# EAGLE design pcb_Vgood (EAGLE 9.3.0)
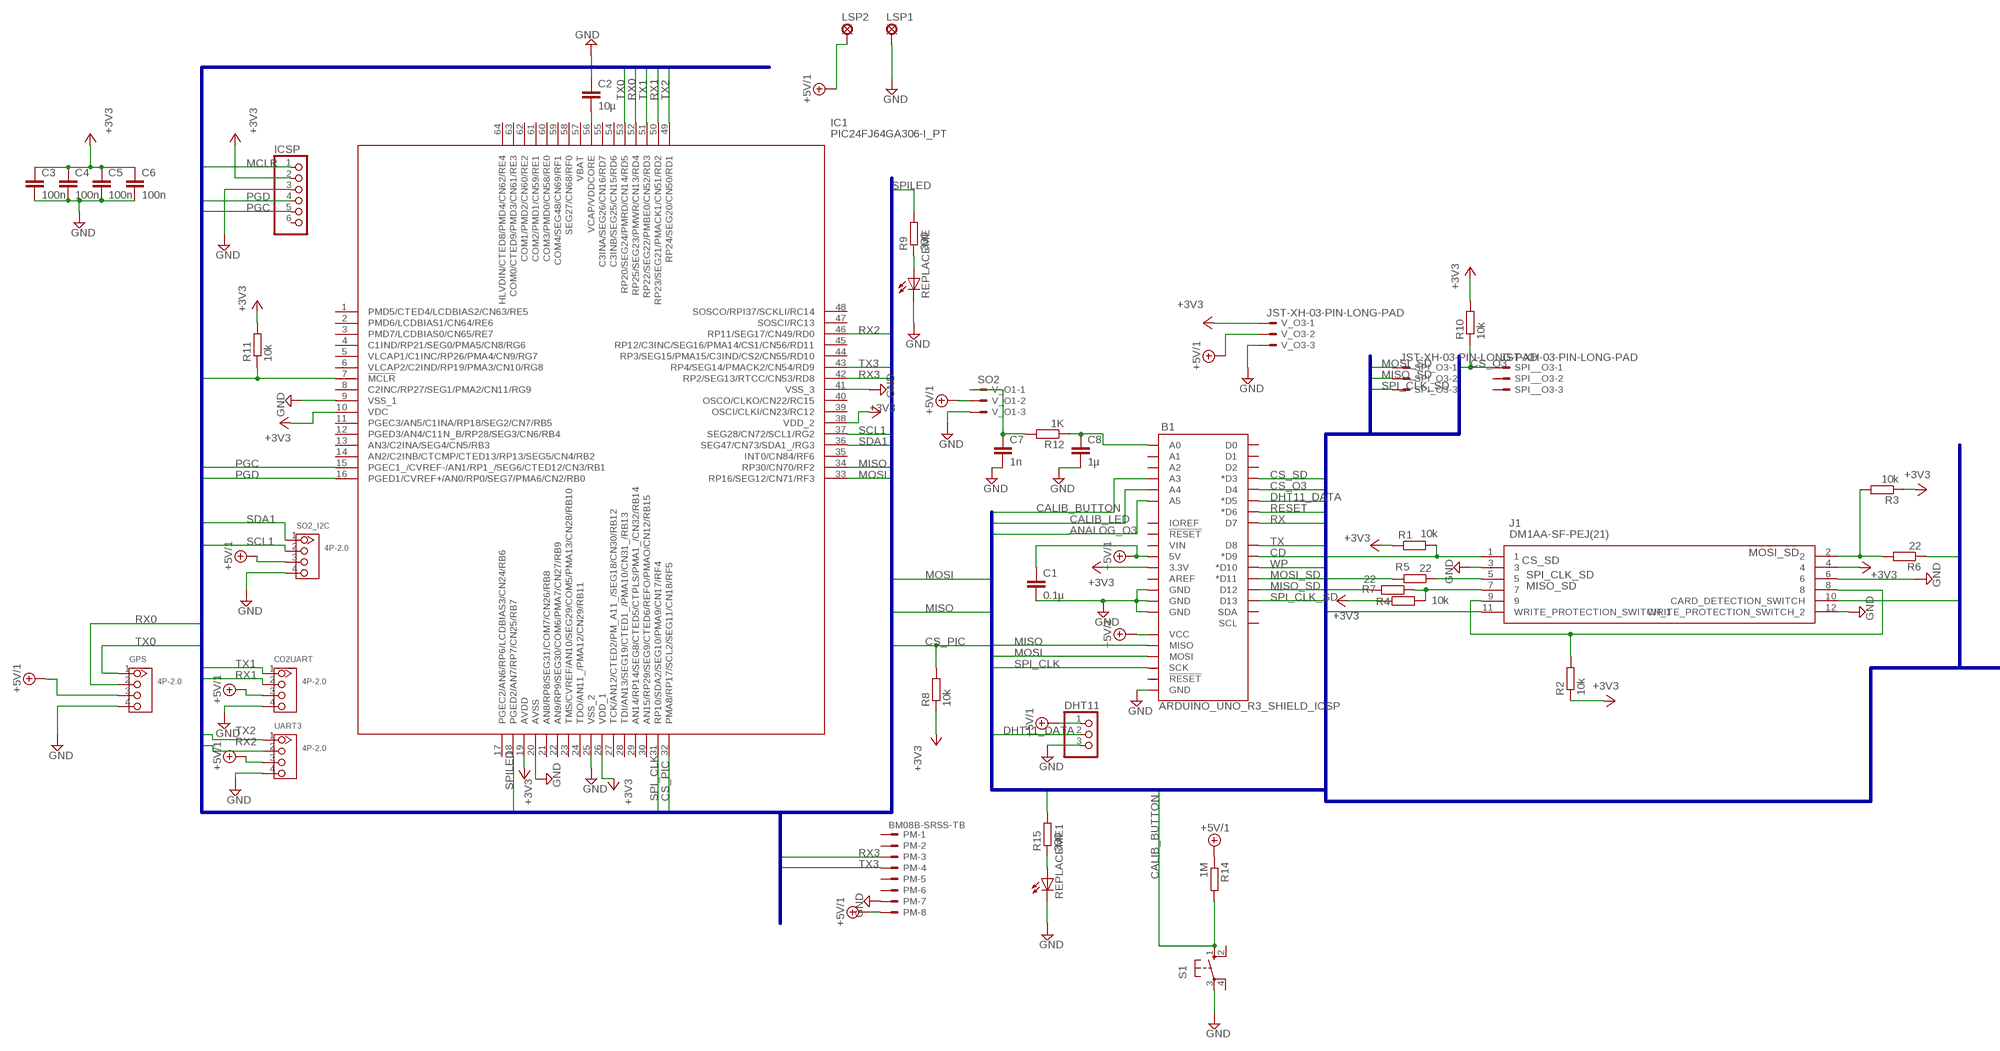
[diagram p0: schematic, sheet 1, part 1 of 2]
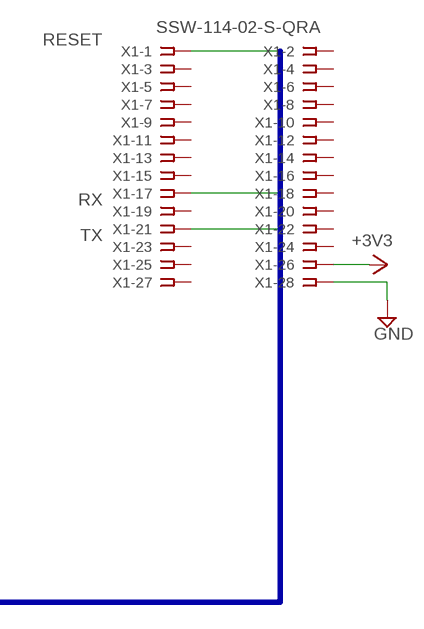
[diagram p1: schematic, sheet 1, part 2 of 2]

## Parts
B1  ARDUINO_UNO_R3_SHIELD_ICSP  [UNO_R3_SHIELD_ICSP]
C1  0.1µ  C-EUC0805  [C0805]
C2  10µ  C-EUC0805  [C0805]
C3  100n  C-EUC0805  [C0805]
C4  100n  C-EUC0805  [C0805]
C5  100n  C-EUC0805  [C0805]
C6  100n  C-EUC0805  [C0805]
C7  1n  C-EUC0805  [C0805]
C8  1µ  C-EUC0805  [C0805]
CO2UART  4P-2.0  GROVE-CONNECTOR-DIP(4P-2.0)  [HW4-2.0]
DHT11  PINHD-1X3  [1X03]
GPS  4P-2.0  GROVE-CONNECTOR-DIP(4P-2.0)  [HW4-2.0]
IC1  PIC24FJ64GA306-I_PT  [QFP50P1200X1200X120-64N]
ICSP  PINHD-1X6  [1X06]
J1  DM1AA-SF-PEJ(21)  [DM1AA-SF-PEJ(21)_1]
LSP1  GND  SE14  [SE14]
LSP2  5V  SE14  [SE14]
PM  BM08B-SRSS-TB  [BM08B-SRSS-TB]
R1  10k  R-EU_M0805  [M0805]
R2  10k  R-EU_M0805  [M0805]
R3  10k  R-EU_M0805  [M0805]
R4  10k  R-EU_M0805  [M0805]
R5  22  R-EU_M0805  [M0805]
R6  22  R-EU_M0805  [M0805]
R7  22  R-EU_M0805  [M0805]
R8  10k  R-EU_M0805  [M0805]
R9  330  R-EU_M0805  [M0805]
R10  10k  R-EU_M0805  [M0805]
R11  10k  R-EU_M0805  [M0805]
R12  1K  R-EU_M0805  [M0805]
R14  1M  R-EU_M0805  [M0805]
R15  330  R-EU_M0805  [M0805]
REPLACEME  LEDCHIP-LED0805  [CHIP-LED0805]
REPLACEME1  LEDCHIP-LED0805  [CHIP-LED0805]
S1  10-XX  [B3F-10XX]
SO2_I2C  4P-2.0  GROVE-CONNECTOR-DIP(4P-2.0)  [HW4-2.0]
SPI__O3  JST-XH-03-PIN-LONG-PAD  [JST-XH-03-PACKAGE-LONG-PAD]
SPI_O3  JST-XH-03-PIN-LONG-PAD  [JST-XH-03-PACKAGE-LONG-PAD]
UART3  4P-2.0  GROVE-CONNECTOR-DIP(4P-2.0)  [HW4-2.0]
V_O1  SO2  JST-XH-03-PIN-LONG-PAD  [JST-XH-03-PACKAGE-LONG-PAD]
V_O3  JST-XH-03-PIN-LONG-PAD  [JST-XH-03-PACKAGE-LONG-PAD]
X1  SSW-114-02-S-QRA  [SSW-114-02-S-Q-RA]

## Nets
+3V3: B1.3.3V C3.1 C4.1 C5.1 C6.1 IC1.10(VDC) IC1.19(AVDD) IC1.26(VDD_1) IC1.38(VDD_2) ICSP.2 J1.4 R1.1 R2.1 R3.1 R4.1 R8.1 R10.2 R11.2 V_O3.1 X1.26
+5V/1: B1.5V B1.5V_ICSP(VCC) C1.1 CO2UART.3 DHT11.1 GPS.3 LSP2.MP PM.8 R14.1 SO2_I2C.3 UART3.3 V_O1.2 V_O3.2
ANALOG_O3: B1.A5
CALIB_BUTTON: B1.A3 R14.2 S1.1(S)
CALIB_LED: B1.A4 R15.2
CD: B1.D9(*D9) J1.10(CARD_DETECTION_SWITCH)
CS_O3: B1.D4 R10.1 SPI__O3.1
CS_PIC: IC1.32(PMA8/RP17/SCL2/SEG11/CN18/RF5) R8.2
CS_SD: B1.D3(*D3) J1.1 R1.2
DHT11_DATA: B1.D5(*D5) DHT11.2
GND: B1.GND@0(GND) B1.GND@1(GND) B1.GND@2(GND) B1.GND_ICSP(GND) C1.2 C2.1 C3.2 C4.2 C5.2 C6.2 C7.2 C8.2 CO2UART.4 DHT11.3 GPS.4 IC1.9(VSS_1) IC1.20(AVSS) IC1.25(VSS_2) IC1.41(VSS_3) ICSP.3 J1.3 J1.6 J1.12(WRITE_PROTECTION_SWITCH_2) LSP1.MP PM.7 REPLACEME1.C REPLACEME.C S1.3(P) SO2_I2C.4 UART3.4 V_O1.3 V_O3.3 X1.28
MCLR: IC1.7(!MCLR) ICSP.1 R11.1
MISO: B1.MISO IC1.34(RP30/CN70/RF2)
MISO_SD: B1.D12 R7.2 SPI_O3.2
MOSI: B1.MOSI IC1.33(RP16/SEG12/CN71/RF3)
MOSI_SD: B1.D11(*D11) R6.1 SPI_O3.1
N$1: R9.1 REPLACEME.A
N$2: J1.8 J1.9 R2.2
N$3: J1.5 R5.1
N$4: C2.2 IC1.56(VCAP/VDDCORE)
N$5: R15.1 REPLACEME1.A
N$6: J1.2 R3.2 R6.2
N$7: J1.7 R4.2 R7.1
N$8: B1.A0 C8.1 R12.1
N$12: C7.1 R12.2 V_O1.1
PGC: IC1.15(PGEC1_/CVREF-/AN1/RP1_/SEG6/CTED12/CN3/RB1) ICSP.5
PGD: IC1.16(PGED1/CVREF+/AN0/RP0/SEG7/PMA6/CN2/RB0) ICSP.4
RESET: B1.D6(*D6) X1.1
RX: B1.D7 X1.17
RX0: GPS.2 IC1.52(RP25/SEG23/PMWR/CN13/RD4)
RX1: CO2UART.2 IC1.50(RP23/SEG21/PMACK1/CN51/RD2)
RX2: IC1.46(RP11/SEG17/CN49/RD0) UART3.2
RX3: IC1.42(RP2/SEG13/RTCC/CN53/RD8) PM.3
SCL1: IC1.37(SEG28/CN72/SCL1/RG2) SO2_I2C.2
SDA1: IC1.36(SEG47/CN73/SDA1_/RG3) SO2_I2C.1
SPI_CLK: B1.SCK IC1.31(RP10/SDA2/SEG10/PMA9/CN17/RF4)
SPI_CLK_SD: B1.D13 R5.2 SPI_O3.3
SPILED: IC1.18(PGED2/AN7/RP7/CN25/RB7) R9.2
TX: B1.D8 X1.21
TX0: GPS.1 IC1.53(RP20/SEG24/PMRD/CN14/RD5)
TX1: CO2UART.1 IC1.51(RP22/SEG22/PMBE0/CN52/RD3)
TX2: IC1.49(RP24/SEG20/CN50/RD1) UART3.1
TX3: IC1.43(RP4/SEG14/PMACK2/CN54/RD9) PM.4
WP: B1.D10(*D10) J1.11(WRITE_PROTECTION_SWITCH_1)
Unconnected: B1.A1 B1.A2 B1.AREF B1.D2 B1.IOREF B1.RES(!RESET!) B1.RST_ICSP(!RESET!) B1.RX(D0) B1.SCL B1.SDA B1.TX(D1) B1.VIN IC1.1(PMD5/CTED4/LCDBIAS2/CN63/RE5) IC1.2(PMD6/LCDBIAS1/CN64/RE6) IC1.3(PMD7/LCDBIAS0/CN65/RE7) IC1.4(C1IND/RP21/SEG0/PMA5/CN8/RG6) IC1.5(VLCAP1/C1INC/RP26/PMA4/CN9/RG7) IC1.6(VLCAP2/C2IND/RP19/PMA3/CN10/RG8) IC1.8(C2INC/RP27/SEG1/PMA2/CN11/RG9) IC1.11(PGEC3/AN5/C1INA/RP18/SEG2/CN7/RB5) IC1.12(PGED3/AN4/C11N_B/RP28/SEG3/CN6/RB4) IC1.13(AN3/C2INA/SEG4/CN5/RB3) IC1.14(AN2/C2INB/CTCMP/CTED13/RP13/SEG5/CN4/RB2) IC1.17(PGEC2/AN6/RP6/LCDBIAS3/CN24/RB6) IC1.21(AN8/RP8/SEG31/COM7/CN26/RB8) IC1.22(AN9/RP9/SEG30/COM6/PMA7/CN27/RB9) IC1.23(TMS/CVREF/AN10/SEG29/COM5/PMA13/CN28/RB10) IC1.24(TDO/AN11_/PMA12/CN29/RB11) IC1.27(TCK/AN12/CTED2/PM_A11_/SEG18/CN30/RB12) IC1.28(TDI/AN13/SEG19/CTED1_/PMA10/CN31_/RB13) IC1.29(AN14/RP14/SEG8/CTED5/CTPLS/PMA1_/CN32/RB14) IC1.30(AN15/RP29/SEG9/CTED6/REFO/PMAO/CN12/RB15) IC1.35(INT0/CN84/RF6) IC1.39(OSCI/CLKI/CN23/RC12) IC1.40(OSCO/CLKO/CN22/RC15) IC1.44(RP3/SEG15/PMA15/C3IND/CS2/CN55/RD10) IC1.45(RP12/C3INC/SEG16/PMA14/CS1/CN56/RD11) IC1.47(SOSCI/RC13) IC1.48(SOSCO/RPI37/SCKLI/RC14) IC1.54(C3INB/SEG25/CN15/RD6) IC1.55(C3INA/SEG26/CN16/RD7) IC1.57(VBAT) IC1.58(SEG27/CN68/RF0) IC1.59(COM4/SEG48/CN69/RF1) IC1.60(COM3/PMD0/CN58/RE0) IC1.61(COM2/PMD1/CN59/RE1) IC1.62(COM1/PMD2/CN60/RE2) IC1.63(COM0/CTED9/PMD3/CN61/RE3) IC1.64(HLVDIN/CTED8/PMD4/CN62/RE4) ICSP.6 PM.1 PM.2 PM.5 PM.6 S1.2(S1) S1.4(P1) SPI__O3.2 SPI__O3.3 X1.2 X1.3 X1.4 X1.5 X1.6 X1.7 X1.8 X1.9 X1.10 X1.11 X1.12 X1.13 X1.14 X1.15 X1.16 X1.18 X1.19 X1.20 X1.22 X1.23 X1.24 X1.25 X1.27

## Buses
GPIO_[0..7],SDA,SCL,WAKEUP,TX,RX,RESET,GPIO_2_[0..7],MOSI,MISO,CS_O3,CS_SD,SPI_CLK,WP,CD,WAKEUP_2,DHT11_DATA,RX_2,TX_2,CS_PIC,ANALOG_O3,CALIB_BUTTON,CALIB_LED,SPI_CLK_SD,MISO_SD,MOSI_SD
SPILED,PGD,PGC,MOSI,MISO,SPI_CLK,CS_PIC,RX[0..3],TX[0..3],MCLR,SDA1,SCL1

## Library data of the parts
B1 = SparkFun-Boards:ARDUINO_UNO_R3_SHIELD_ICSP: Arduino R3 Shield Footprint with ICSP Header Includes pins for 6-pin (2x3) ICSP Header. Compatible with Leonardo boards that require SPI pin connections via this header. SparkFun Products: CryptoShield <https://www.sparkfun.com/products/13183> microSD Shield <https://www.sparkfun.com/products/12761> R3 Stackable Headers Kit <https://www.sparkfun.com/products/1417>
C1-C8 = rcl:C-EU: CAPACITOR, European symbol
CO2UART GPS SO2_I2C UART3 = OPL_Connector:GROVE-CONNECTOR-DIP(4P-2.0): 320110033
DHT11 = pinhead:PINHD-1X3: PIN HEADER
IC1 = SamacSys_Parts:PIC24FJ64GA306-I_PT: MICROCHIP - PIC24FJ64GA306-I/PT - MCU, 16BIT, PIC24, 32MHZ, TQFP-64 Source: Datasheet <https://componentsearchengine.com/Datasheets/1/PIC24FJ64GA306-I_PT.pdf>; DESCRIPTION: MICROCHIP - PIC24FJ64GA306-I/PT - MCU, 16BIT, PIC24, 32MHZ, TQFP-64; HEIGHT: 1.2mm; MANUFACTURER_NAME: Microchip; MANUFACTURER_PART_NUMBER: PIC24FJ64GA306-I/PT; MOUSER_PART_NUMBER: 579-24FJ64GA306-I/PT; MOUSER_PRICE-STOCK: https://www.mouser.com/Search/Refine.aspx?Keyword=579-24FJ64GA306-I%2FPT
ICSP = pinhead:PINHD-1X6: PIN HEADER
J1 = SamacSys_Parts:DM1AA-SF-PEJ(21): Memory Card Connectors SD MEM CD CONN R/A SMT PUSHPUSH Source: Datasheet <https://componentsearchengine.com/Datasheets/1/DM1AA-SF-PEJ(21).pdf>; DESCRIPTION: Memory Card Connectors SD MEM CD CONN R/A SMT PUSHPUSH; HEIGHT: mm; MANUFACTURER_NAME: Hirose; MANUFACTURER_PART_NUMBER: DM1AA-SF-PEJ(21); MOUSER_PART_NUMBER: 798-DM1AA-SF-PEJ21; MOUSER_PRICE-STOCK: https://www.mouser.com/Search/Refine.aspx?Keyword=798-DM1AA-SF-PEJ21
LSP1 LSP2 = solpad:SE14: SOLDER PAD E1553, drill 1,4mm, distributor Buerklin, 07F820
PM = con-jst2:?M08B-SRSS-TB: Disconnectable Crimp style connector, 1.0mm pitch 8 contacts
R1-R12 R14 R15 = rcl:R-EU_: RESISTOR, European symbol
REPLACEME REPLACEME1 = led:LED: LED OSRAM: - CHIPLED LG R971, LG N971, LY N971, LG Q971, LY Q971, LO R971, LY R971 LH N974, LH R974 LS Q976, LO Q976, LY Q976 LO Q996 - Hyper CHIPLED LW Q18S LB Q993, LB Q99A, LB R99A - SideLED LS A670, LO A670, LY A670, LG A670, LP A670 LB A673, LV A673, LT A673, LW A673 LH A674 LY A675 LS A676, LA A676, LO A676, LY A676, LW A676 LS A679, LY A679, LG A679 - Hyper Micro SIDELED® LS Y876, LA Y876, LO Y876, LY Y876 LT Y87S - SmartLED LW L88C, LW L88S LB L89C, LB L89S, LG L890 LS L89K, LO L89K, LY L89K LS L896, LA L896, LO L896, LY L896 - TOPLED LS T670, LO T670, LY T670, LG T670, LP T670 LSG T670, LSP T670, LSY T670, LOP T670, LYG T670 LG T671, LOG T671, LSG T671 LB T673, LV T673, LT T673, LW T673 LH T674 LS T676, LA T676, LO T676, LY T676, LB T676, LH T676, LSB T676, LW T676 LB T67C, LV T67C, LT T67C, LS T67K, LO T67K, LY T67K, LW E67C LS E67B, LA E67B, LO E67B, LY E67B, LB E67C, LV E67C, LT E67C LW T67C LS T679, LY T679, LG T679 LS T770, LO T770, LY T770, LG T770, LP T770 LB T773, LV T773, LT T773, LW T773 LH T774 LS E675, LA E675, LY E675, LS T675 LS T776, LA T776, LO T776, LY T776, LB T776 LHGB T686 LT T68C, LB T68C - Hyper Mini TOPLED® LB M676 - Mini TOPLED Santana® LG M470 LS M47K, LO M47K, LY M47K Source: http://www.osram.convergy.de LUXEON: - LUMILED® LXK2-PW12-R00, LXK2-PW12-S00, LXK2-PW14-U00, LXK2-PW14-V00 LXK2-PM12-R00, LXK2-PM12-S00, LXK2-PM14-U00 LXK2-PE12-Q00, LXK2-PE12-R00, LXK2-PE12-S00, LXK2-PE14-T00, LXK2-PE14-U00 LXK2-PB12-K00, LXK2-PB12-L00, LXK2-PB12-M00, LXK2-PB14-N00, LXK2-PB14-P00, LXK2-PB14-Q00 LXK2-PR12-L00, LXK2-PR12-M00, LXK2-PR14-Q00, LXK2-PR14-R00 LXK2-PD12-Q00, LXK2-PD12-R00, LXK2-PD12-S00 LXK2-PH12-R00, LXK2-PH12-S00 LXK2-PL12-P00, LXK2-PL12-Q00, LXK2-PL12-R00 Source: www.luxeon.com KINGBRIGHT: KA-3528ASYC Source: www.kingbright.com
S1 = switch-omron:10-XX: OMRON SWITCH; MPN: B3F-1000; OC_FARNELL: 176432; OC_NEWARK: 36M3542
SPI__O3 SPI_O3 V_O1 V_O3 = Rembrandt Electronics - JST XH Connectors v1-0 (1):JST-XH-03-PIN: JST XH Connector 2 Pin Wire to board connector. Pitch: 2,54 mm, (0.100") Number of pins: 3 Created by Rembrandt Electronics www.rembrandtelectronics.com
X1 = con-samtec:SSW-114-02-S-Q: THROUGH-HOLE .025" SQ POST SOCKET Source: Samtec SSW.pdf; OC_FARNELL: unknown; OC_NEWARK: unknown

## Board
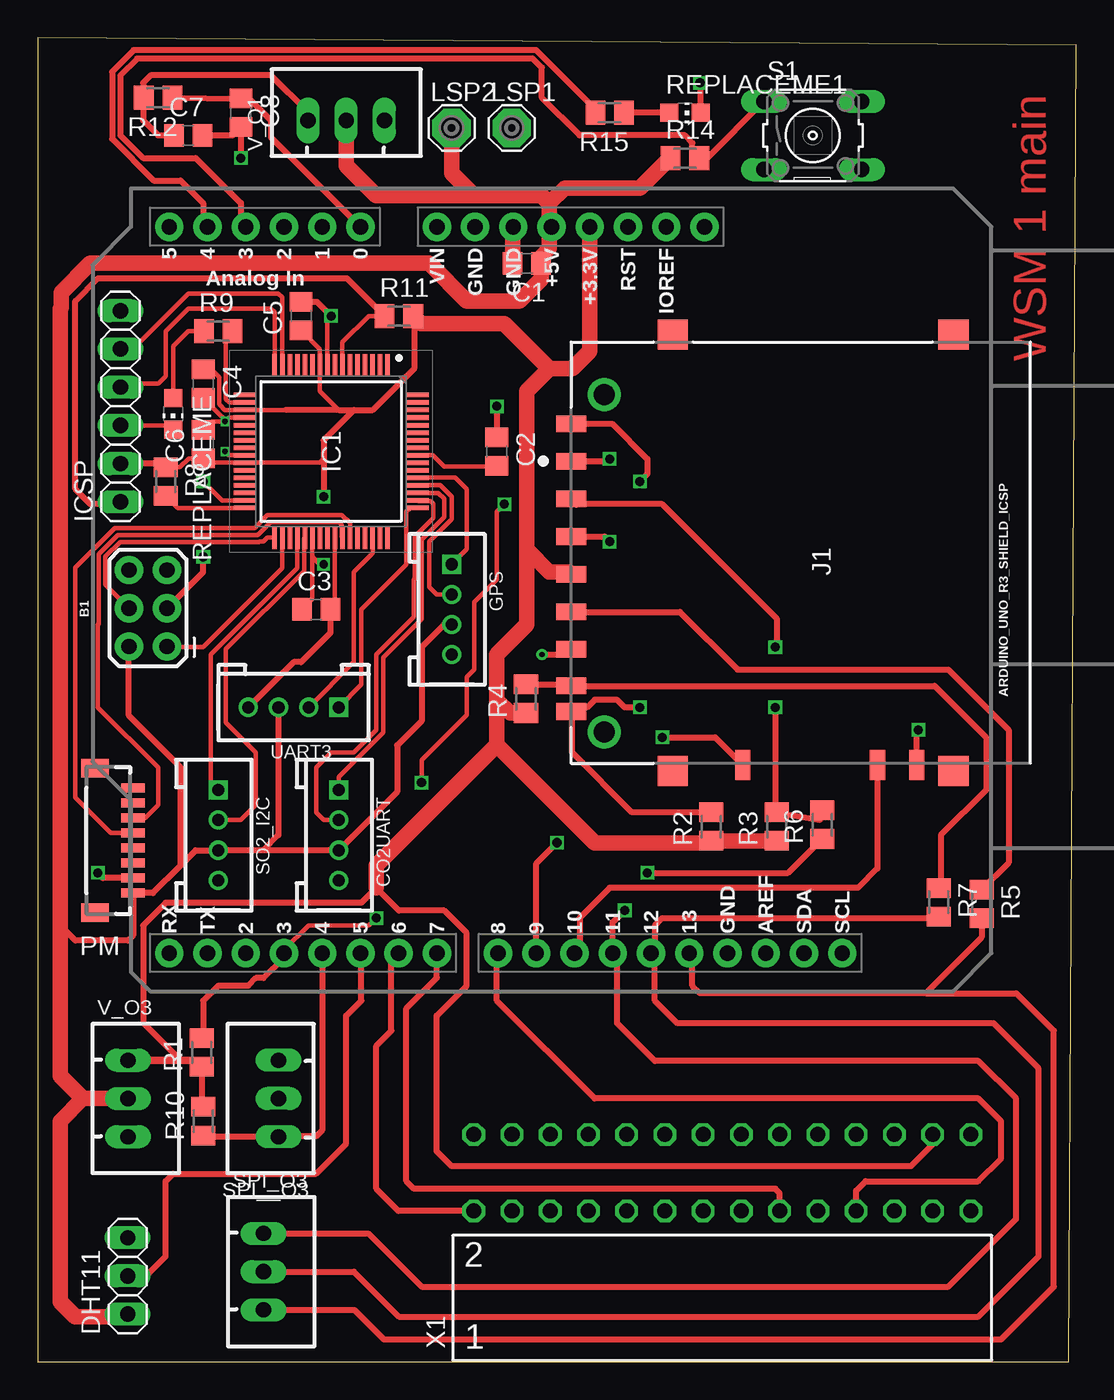
[diagram p2: board, top side]
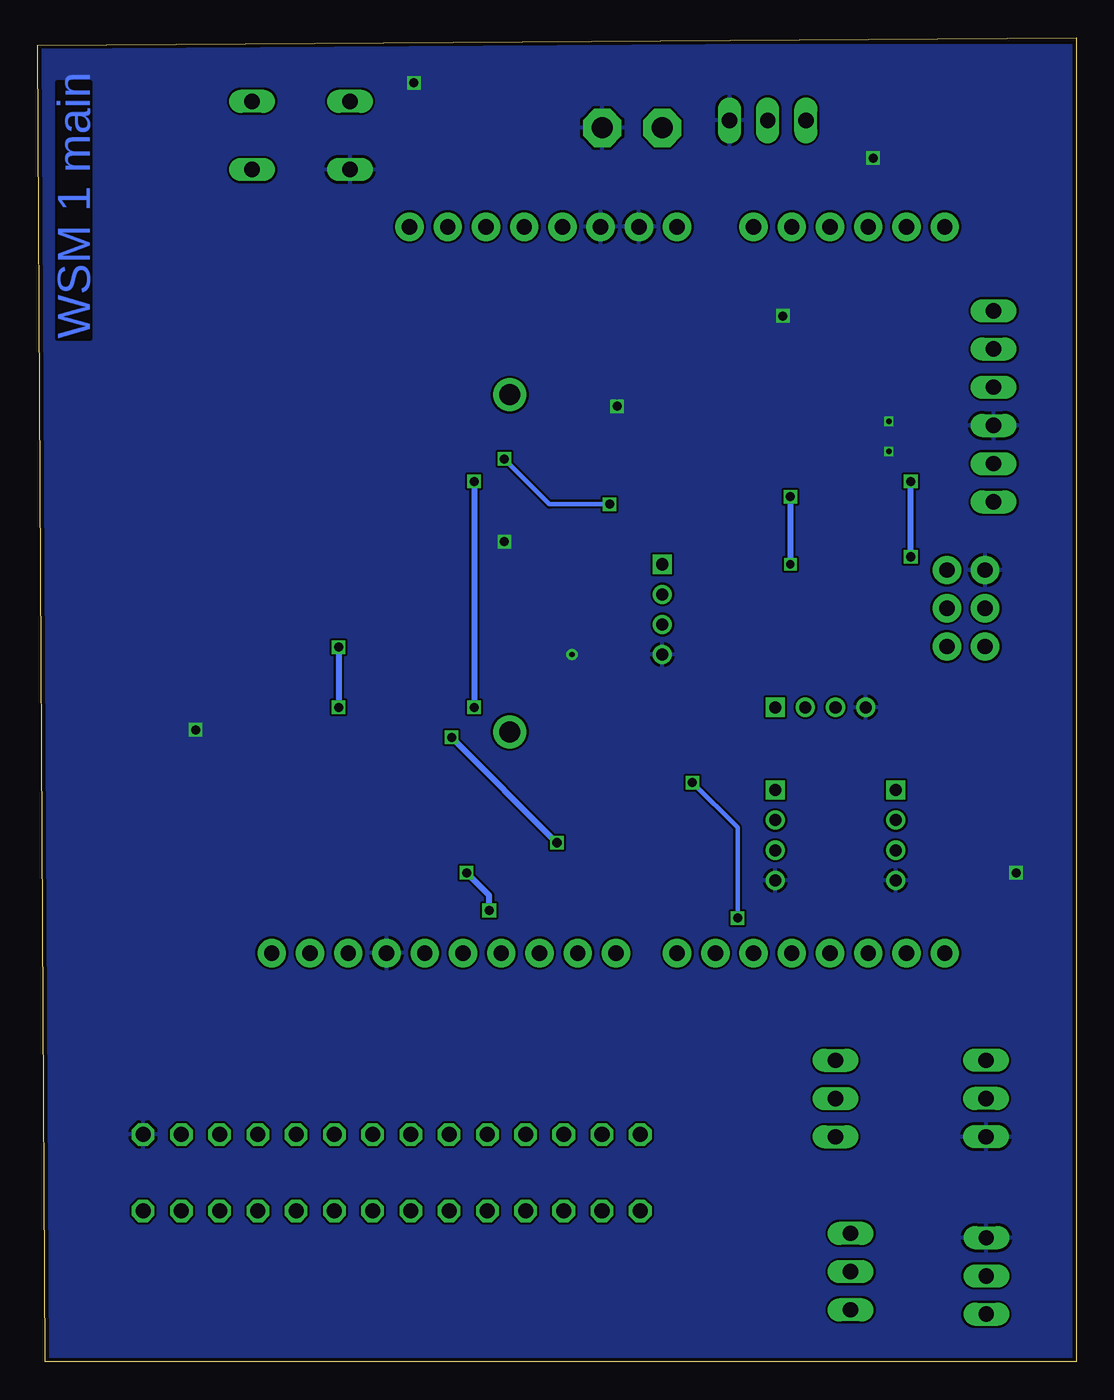
[diagram p3: board, bottom side, seen from below]

Size 69 x 88 mm. Coordinates in mm from the lower left corner, seen from the top.
Outline: 0,0 68.5,0 69,87.5 0,88 0,0
Copper layers (1*16): Top 0.018mm / dielectric 1.55mm / Bottom 0.018mm
Design rules "eC_2Layer_PClass6_BaseCopperO18_eCDefault": minimum track width 0.15mm, minimum drill 0.35mm, track to track 0.15mm, track to pad 0.15mm, pad to pad 0.15mm, via to via 0.15mm, smd to smd 0mil, copper to edge 0.25mm, drill to drill 0.35mm, minimum pad ring 0.175mm, minimum via ring 0.125mm, stop-mask expansion 0mil, vias tented up to drill 0.45mm, thermal gap 0.2mm

### Footprints (pad centres in the part's own frame; a part is rotated, then mirrored left to right if it is on the bottom)
UNO_R3_SHIELD_ICSP = drill 1.016 pad 1.88: 3.3V 24.13,-3.81; 5V 24.13,-1.27; 5V_ICSP -3.76,26.81; A0 24.13,11.43; A1 24.13,13.97; A2 24.13,16.51; A3 24.13,19.05; A4 24.13,21.59; A5 24.13,24.13; AREF -24.13,-15.494; D2 -24.13,19.05; D3 -24.13,16.51; D4 -24.13,13.97; D5 -24.13,11.43; D6 -24.13,8.89; D7 -24.13,6.35; D8 -24.13,2.286; D9 -24.13,-0.254; D10 -24.13,-2.794; D11 -24.13,-5.334; D12 -24.13,-7.874; D13 -24.13,-10.414; GND@0 24.13,1.27; GND@1 24.13,3.81; GND@2 -24.13,-12.954; GND_ICSP 1.32,26.81; IOREF 24.13,-8.89; MISO -3.76,24.27; MOSI -1.22,26.81; NC 24.13,-11.43; RES 24.13,-6.35; RST_ICSP 1.32,24.27; RX -24.13,24.13; SCK -1.22,24.27; SCL -24.13,-20.574; SDA -24.13,-18.034; TX -24.13,21.59; VIN 24.13,6.35
C0805 = smd 1.3 x 1.5: 1 -0.95,0; 2 0.95,0
HW4-2.0 = drill 0.8 pad 1.27 square: 1 -3,0 | drill 0.8 pad 1.27: 2 -1,0; 3 1,0; 4 3,0
1X03 = drill 1.016 long: 1 -2.54,0; 2 0,0; 3 2.54,0
QFP50P1200X1200X120-64N = smd 1.475 x 0.3: 1 -5.738,3.75; 2 -5.738,3.25; 3 -5.738,2.75; 4 -5.738,2.25; 5 -5.738,1.75; 6 -5.738,1.25; 7 -5.738,0.75; 8 -5.738,0.25; 9 -5.738,-0.25; 10 -5.738,-0.75; 11 -5.738,-1.25; 12 -5.738,-1.75; 13 -5.738,-2.25; 14 -5.738,-2.75; 15 -5.738,-3.25; 16 -5.738,-3.75; 33 5.738,-3.75; 34 5.738,-3.25; 35 5.738,-2.75; 36 5.738,-2.25; 37 5.738,-1.75; 38 5.738,-1.25; 39 5.738,-0.75; 40 5.738,-0.25; 41 5.738,0.25; 42 5.738,0.75; 43 5.738,1.25; 44 5.738,1.75; 45 5.738,2.25; 46 5.738,2.75; 47 5.738,3.25; 48 5.738,3.75 | smd 0.3 x 1.475: 17 -3.75,-5.738; 18 -3.25,-5.738; 19 -2.75,-5.738; 20 -2.25,-5.738; 21 -1.75,-5.738; 22 -1.25,-5.738; 23 -0.75,-5.738; 24 -0.25,-5.738; 25 0.25,-5.738; 26 0.75,-5.738; 27 1.25,-5.738; 28 1.75,-5.738; 29 2.25,-5.738; 30 2.75,-5.738; 31 3.25,-5.738; 32 3.75,-5.738; 49 3.75,5.738; 50 3.25,5.738; 51 2.75,5.738; 52 2.25,5.738; 53 1.75,5.738; 54 1.25,5.738; 55 0.75,5.738; 56 0.25,5.738; 57 -0.25,5.738; 58 -0.75,5.738; 59 -1.25,5.738; 60 -1.75,5.738; 61 -2.25,5.738; 62 -2.75,5.738; 63 -3.25,5.738; 64 -3.75,5.738
1X06 = drill 1.016 long: 1 -6.35,0; 2 -3.81,0; 3 -1.27,0; 4 1.27,0; 5 3.81,0; 6 6.35,0
DM1AA-SF-PEJ(21)_1 = smd 1.1 x 2: 1 17.975,2.2; 2 15.475,2.2; 3 12.975,2.2; 4 10.475,2.2; 5 7.975,2.2; 6 5.475,2.2; 7 3.05,2.2; 8 1.35,2.2; 9 20.475,2.2 | smd 2 x 1: 10 -2.2,-9.2; 11 -2.2,-18.15; 12 -2.2,-20.75 | smd 2 x 2: 13 -2.6,-23.2; 14 26.4,-23.2; 15 26.4,-4.55; 16 -2.6,-4.55 | drill 1.4 pad 2.2: 17 0,0; 18 22.4,0
SE14 = drill 1.397 pad 2.54 octagon: MP 0,0
BM08B-SRSS-TB = smd 0.6 x 1.55: 1 3.5,-1.625; 2 2.5,-1.625; 3 1.5,-1.625; 4 0.5,-1.625; 5 -0.5,-1.625; 6 -1.5,-1.625; 7 -2.5,-1.625; 8 -3.5,-1.625 | smd 1.2 x 1.8: FIT@1 4.8,0.9; FIT@2 -4.8,0.9
M0805 = smd 1.3 x 1.6: 1 -0.95,0; 2 0.95,0
CHIP-LED0805 = smd 1.2 x 1.2: A 0,-1.05; C 0,1.05
B3F-10XX = drill 1.016 long: 1 -3.251,2.261; 2 3.251,2.261; 3 -3.251,-2.261; 4 3.251,-2.261
JST-XH-03-PACKAGE-LONG-PAD = drill 1.016 long: 1 -2.54,0; 2 0,0; 3 2.54,0
SSW-114-02-S-Q-RA = drill 1 pad 1.5 octagon: 1 -16.51,1.524; 2 -16.51,6.604; 3 -13.97,1.524; 4 -13.97,6.604; 5 -11.43,1.524; 6 -11.43,6.604; 7 -8.89,1.524; 8 -8.89,6.604; 9 -6.35,1.524; 10 -6.35,6.604; 11 -3.81,1.524; 12 -3.81,6.604; 13 -1.27,1.524; 14 -1.27,6.604; 15 1.27,1.524; 16 1.27,6.604; 17 3.81,1.524; 18 3.81,6.604; 19 6.35,1.524; 20 6.35,6.604; 21 8.89,1.524; 22 8.89,6.604; 23 11.43,1.524; 24 11.43,6.604; 25 13.97,1.524; 26 13.97,6.604; 27 16.51,1.524; 28 16.51,6.604

### Placement (x,y rotation side)
B1  32.87,51.3 90 top
C1  32.5,73 180 top
C2  30.5,60.5 270 top
C3  18.5,50 0 top
C4  11,65 270 top
C5  17.5,69.5 90 top
C6  11,61 90 top
C7  10,81.5 0 top
C8  13.5,83 270 top
CO2UART  20,35 270 top
DHT11  5.98,5.71 90 top
GPS  27.5,50 270 top
IC1  19.5,60.5 270 top
ICSP  5.5,63.5 90 top
J1  37.64,41.87 90 top
LSP1  31.5,82 0 top
LSP2  27.5,82 0 top
PM  4.71,34.65 90 top
R1  10.89,20.57 90 top
R2  44.74,35.57 90 top
R3  49.09,35.57 90 top
R4  32.44,44.07 90 top
R5  62.71,30.43 270 top
R6  52.11,35.7 90 top
R7  59.85,30.54 270 top
R8  8.5,58.5 270 top
R9  12,68.5 0 top
R10  11,16 90 top
R11  24,69.5 0 top
R12  8,84 180 top
R14  43,80 0 top
R15  38,83 180 top
REPLACEME  9,63 180 top
REPLACEME1  43,83 270 top
S1  51.5,81.5 0 top
SO2_I2C  12,35 270 top
SPI__O3  16,17.5 90 top
SPI_O3  15,6 270 top
UART3  17,43.5 180 top
V_O1  20.5,82.5 0 top
V_O3  6,17.5 270 top
X1  45.48,8.51 0 top

### Tracks (layer width: path | path; a pad name or v marks a point on that pad's centre or on a via)
+3V3  (via drill 0.55, 0.6)
  Top 0.305: 16.5,63.25 IC1.19 12.44,63.25 12.05,63.64 12.05,65.45 11.55,65.95 C4.1 | 18.25,53.5 18.25,50.7 C3.1 | 18.25,53.5 IC1.38 | C5.1 18.75,67.3 IC1.10 18.75,64.5 20,63.25 | 11.03,60.02 11.3,59.75 IC1.26 18.75,59.75 19,60 | 11.03,60.02 C6.1 | R8.1 9.45,59.45 10.03,60.02 11.03,60.02 | v19,53 18.75,53 18.25,53.5
  Top 0.406: R1.1 10.89,17.06 R10.2 | 9.5,20.04 7,22.54 7,29 8.5,30.5 21.5,30.5 22.5,31.5 24,30 27,30 28.5,28.5 28.5,25 26.5,23 26.5,14 27.5,13 58,13 59.45,14.45 X1.26 | 21,63.25 20,63.25 16.5,63.25 | 21,63.25 22.25,63.25 25.05,66.05 25.05,69.4 R11.2 | 21,63.25 19,61.25 19,60 v19,57.5 | ICSP.2 8.26,59.69 R8.1
  Top 0.508: R1.1 10.47,20.04 9.5,20.04 V_O3.1
  Top 1.016: B1.3.3V 36.68,67.18 35.5,66 34,66 | 34,66 32.5,64.5 32.5,54 | 34,66 31,69 25.45,69 R11.2 | 32.5,54 32.5,49 30.5,47 30.5,44 | 30.5,41 37,34.5 44.62,34.5 R2.1 R3.1 | 30.5,44 30.5,41 | 22.5,31.5 22.5,33 30.5,41 | R4.1 31.38,43.12 30.5,44 | 32.5,54 34,52.5 35.28,52.5 J1.4
  Bottom 0.406: v19,57.5 v19,53
+5V/1
  Top 0.406: 15,34 SO2_I2C.3 10.5,34 9.5,33 | 15,34 CO2UART.3 23.89,37.89 23.89,40.96 25.5,42.57 25.5,47.5 27,49 GPS.3 | 9.5,33 7.65,31.15 PM.8 6.33,28.34 6,28 2.5,28 1.5,29 | UART3.3 16,35 15,34 | 9.5,33 9.5,39.5 6.06,42.94 B1.5V_ICSP | 34,75.57 B1.5V 34,75.29
  Top 1.016: 34,75.29 34,74 33.45,73.45 C1.1 33.45,71.95 32,70.5 28.5,70.5 26,73 3.5,73 1.57,71.07 1.57,70.07 1.5,70 1.5,29 1.5,19 3,17.5 | 3,17.5 1.5,16 1.5,4 2.5,3 5.81,3 DHT11.1 | 34,75.57 34,77 | 34,77 33.5,77.5 29,77.5 | 34,77 35,78 40,78 42,80 R14.1 | 29,77.5 22.5,77.5 20.5,79.5 V_O1.2 | LSP2.MP 27.5,79 29,77.5 | V_O3.2 3,17.5
CALIB_BUTTON
  Top 0.406: S1.1 44.49,80 R14.2 43.5,80.45 43.5,81 43,81.5 36,81.5 33.5,84 33.5,86 32.89,86.61 6.61,86.61 5.5,85.5 5.5,81.5 7,80 10.5,80 13.5,77 13.5,75.75 B1.A3
CALIB_LED
  Top 0.406: B1.A4 11,75.71 11,77 9.5,78.5 7.71,78.5 4.94,81.27 4.94,85.73 6.38,87.17 33.12,87.17 37.05,83.24 R15.2
CD  (via drill 0.6)
  Top 0.406: B1.D9 33.12,33.12 v34.5,34.5 | v41.5,41.5 45.01,41.5 J1.10
  Bottom 0.406: v34.5,34.5 v41.5,41.5
CS_O3
  Top 0.406: B1.D4 18.9,15.4 18.5,15 16.04,15 SPI__O3.1 11.09,14.96 R10.1
CS_PIC
  Top 0.305: IC1.32 10,56.75 9.8,56.75 9.3,56.75 R8.2
CS_SD  (via drill 0.6)
  Top 0.305: B1.D3 16.36,27.36 18,29 22,29 v22.5,29.5 | v25.5,38.5 25.5,40 28.5,43 28.5,45.5 29,46 29,50.5 30.5,52 30.5,56.5 v31,57
  Top 0.406: B1.D3 16.36,26.86 15,25.5 14.5,25.5 14,25 12,25 11,24 11,21.63 R1.2 | J1.1 37.84,59.84 v38,60
  Bottom 0.305: v22.5,29.5 22.5,35.5 v25.5,38.5 | v31,57 35,57 v38,60
DHT11_DATA
  Top 0.406: DHT11.2 7.21,5.71 8.5,7 8.5,12 9,12.5 18.5,12.5 20.5,14.5 20.5,23 21.5,24 21.5,27.11 B1.D5
GND  (via drill 0.35, 0.35 pad 0.75, 0.6)
  Top 0.305: IC1.41 19.75,50.3 C3.2 | IC1.9 19.25,69.25 v19.5,69.5 | IC1.25 12.7,60.25 v12.45,60.5 | IC1.20 12.7,62.75 v12.45,62.5 | C6.2 11.55,62.5 v12.45,62.5 | C4.2 12.45,62.6 v12.45,62.5 | REPLACEME.C 8.72,62.23 ICSP.3
  Top 0.406: J1.6 35.09,47 v33.5,47 | v30.5,63.5 C2.1 | C7.2 12.95,81.5 C8.2 v13.5,80 | REPLACEME1.C 44.05,84.95 v44,85 | J1.3 37.66,54.84 v38,54.5 | PM.7 4.35,32.15 v4,32.5 | J1.12 58.39,41.89 v58.5,42 | C3.2 19.45,48.45 17.5,46.5 17,46.5 UART3.4 | C5.2 18.55,70.45 v19.5,69.5
  Top 0.508: 35.78,54.5 J1.3
  Top 1.016: B1.GND@0 31.55,75.38 C1.2
  pour Bottom: -13.5,78.5 -4.5,87.5 24.5,87.5 105.5,87.5 114.5,78.5 114.5,-7.5 112.5,-9.5 111,-11 -3,-11 -13.5,-0.5
MCLR
  Top 0.305: IC1.7 20.25,67.75 22,69.5 R11.1
  Top 0.406: ICSP.1 5.35,57 3.5,57 2.5,58 2.5,70.5 4,72 20.55,72 R11.1
MISO
  Top 0.305: IC1.34 16.25,52.75 11,47.5 8.64,47.5 B1.MISO
MISO_SD
  Top 0.406: SPI_O3.2 21,6 24,3 62.5,3 66.5,7 66.5,19.5 63.5,22.5 42.5,22.5 41,24 41,26.91 B1.D12 41,27.43 41,29 41.5,29.5 59.76,29.5 R7.2
MOSI
  Top 0.305: IC1.33 15.26,54.76 15,54.5 14.71,54.5 14.71,54.49 5.49,54.49 4.5,53.5 4.5,51.64 B1.MOSI
MOSI_SD  (via drill 0.6)
  Top 0.406: SPI_O3.1 21.96,8.54 25.5,5 60.5,5 65,9.5 65,17.5 62.5,20 41,20 38.5,22.5 38.5,26.87 B1.D11 38.2,29.2 v39,30 | v40.5,32.5 49.86,32.5 R6.1
  Bottom 0.406: v39,30 39,31 v40.5,32.5
N$1
  Top 0.305: R9.1 10,68.5 9,67.5 REPLACEME.A
N$2  (via drill 0.6)
  Top 0.406: R2.2 39.48,36.52 35.5,40.5 35.5,43.16 J1.8 35.72,43.5 36.5,43.5 37,44 38.5,44 39,43.5 v40,43.5 | J1.9 38.16,62.34 40.5,60 40.5,59 v40,58.5
  Bottom 0.406: v40,58.5 v40,43.5
N$3
  Top 0.406: J1.5 42.66,49.84 46.5,46 60.5,46 64.5,42 64.5,33.17 R5.1
N$4
  Top 0.305: IC1.56 26.25,60.25 27,59.5 30.45,59.5 C2.2
  Top 0.406: C2.2 30.45,59.5
N$5
  Top 0.406: REPLACEME1.A R15.1
N$6  (via drill 0.6)
  Top 0.406: 35.78,57 41.5,57 49.09,49.41 49.09,47.59 v49,47.5 | R6.2 51.98,36.02 R3.2 49,36.11 v49,43.5
  Top 0.508: 35.78,57 J1.2
  Bottom 0.406: v49,47.5 v49,43.5
N$7
  Top 0.406: R4.2 35.34,45.02 J1.7 59.58,44.92 63,41.5 63,38 60,35 60,31.64 R7.1
N$8
  Top 0.406: R12.1 C8.1 14.05,83.95 15.5,82.5 15.5,81.37 B1.A0
N$12
  Top 0.406: V_O1.1 17.96,83.04 15.5,85.5 7.5,85.5 7,85 7,84.05 R12.2 7,83.95 7,82.5 8,81.5 C7.1
PGC
  Top 0.305: ICSP.5 6.31,67.31 10,71 16,71 16.25,70.75 IC1.15
PGD
  Top 0.305: IC1.16 15.75,69.75 15.5,70 10,70 8.5,68.5 8.5,65.5 8,65 5.73,65 ICSP.4
RESET
  Top 0.406: X1.1 23.97,10.03 22.5,11.5 22.5,21 23.5,22 23.5,26.69 B1.D6
RX
  Top 0.406: X1.17 49.29,11.21 49,11.5 25,11.5 24.5,12 24.5,23.5 26.52,25.52 B1.D7
RX0
  Top 0.305: IC1.52 26.75,58.25 27.5,57.5 27.5,56 26,54.5 26,51.5 26.5,51 GPS.2
RX1
  Top 0.305: IC1.50 25.28,57.2 26.1,57.2 26.28,57.02 26.28,56.06 25.05,54.83 25.05,52.05 25,52 25,49.5 22.5,47 22.5,42 21,40.5 19.5,40.5 18.5,39.5 18.5,36.5 19,36 CO2UART.2
RX2
  Top 0.305: IC1.46 22.25,53.75 21,52.5 21,46.5 UART3.2
RX3
  Top 0.305: IC1.42 20.2,54.81 20.2,55.62 20.02,55.8 15.47,55.8 14.67,55 14.66,55 14.62,54.95 5.31,54.95 4.04,53.69 4.04,49.05 4,49 4,43.5 8,39.5 8,37 7.15,36.15 PM.3
SCL1
  Top 0.305: SO2_I2C.2 13.5,36 14.5,37 14.5,40.5 12.5,42.5 12.5,47.36 17.7,52.56 17.7,54.72 IC1.37
SDA1
  Top 0.305: SO2_I2C.1 11.5,38.5 11.5,47 17.25,52.75 IC1.36
SPI_CLK  (via drill 0.6)
  Top 0.305: IC1.31 12.25,57.25 v11,58.5
  Top 0.406: B1.SCK 11,52.48 v11,53.5
  Bottom 0.406: v11,53.5 v11,58.5
SPI_CLK_SD
  Top 0.406: SPI_O3.3 21.04,3.46 23,1.5 64,1.5 67.5,5 67.5,22 65,24.5 59,24.5 | 59,24.5 44,24.5 43.5,25 43.5,26.95 B1.D13 | R5.2 62.71,28.21 59,24.5
SPILED
  Top 0.305: IC1.18 12.75,63.75 12.51,63.99 12.51,68.06 R9.2
TX
  Top 0.406: X1.21 54.37,11.37 55,12 62.5,12 64,13.5 64,16 62.5,17.5 37,17.5 30.5,24 30.5,27.09 B1.D8
TX0
  Top 0.305: IC1.53 27.75,58.75 28.5,58 28.5,54 GPS.1
TX1
  Top 0.305: IC1.51 26.61,57.75 27,57.36 27,56.14 25.5,54.64 25.5,49.36 22.95,46.81 22.95,41.81 20,38.86 CO2UART.1
TX2
  Top 0.305: IC1.49 24.75,56.75 24.5,56.5 24.5,53 21.5,50 21.5,45 UART3.1
TX3
  Top 0.305: IC1.43 20.75,55.75 20.5,56 20.47,56 20.21,56.26 15.26,56.26 14.41,55.41 5.12,55.41 2.5,52.79 2.5,37.5 4.85,35.15 PM.4
WP
  Top 0.406: J1.11 55.79,32.79 54.5,31.5 38,31.5 36,29.5 36,27.51 B1.D10

### Text on the board
Top: WSM 1 main
Bottom: WSM 1 main